# Altium schematic sheet Armado de cable.SchDoc
size 145 x 103 mm
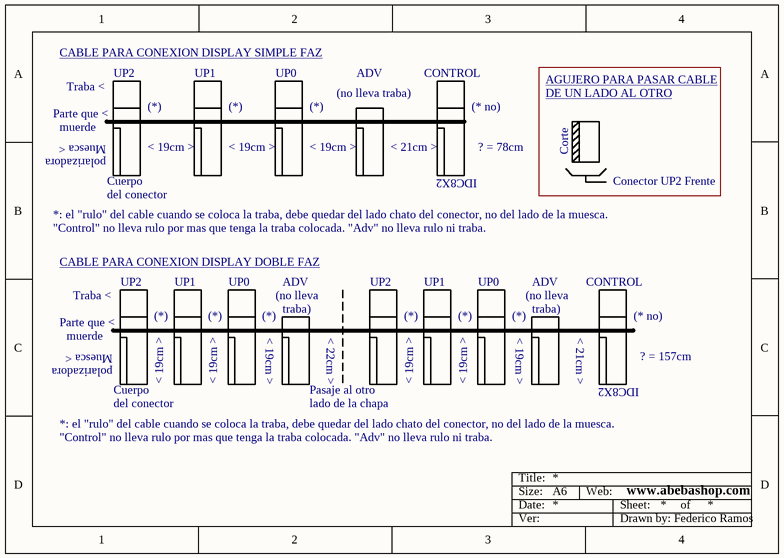
[diagram p0: Armado de cable.SchDoc]

## Notes on the sheet
- CABLE PARA CONEXION DISPLAY SIMPLE FAZ
- Traba <
- UP2
- UP1
- UP0
- (no lleva traba)
- ADV
- CONTROL
- AGUJERO PARA PASAR CABLE
- DE UN LADO AL OTRO
- Parte que <
- muerde
- Muesca <
- polarizadora
- < 19cm >
- (*)
- < 21cm >
- (* no)
- ? = 78cm
- IDC8X2
- Corte
- *: el "rulo" del cable cuando se coloca la traba, debe quedar del lado chato del conector, no del lado de la muesca.
- "Control" no lleva rulo por mas que tenga la traba colocada. "Adv" no lleva rulo ni traba.
- Cuerpo
- del conector
- Conector UP2 Frente
- CABLE PARA CONEXION DISPLAY DOBLE FAZ
- (no lleva
- traba)
- < 22cm >
- ? = 157cm
- Pasaje al otro
- lado de la chapa
- Title:
- Size:
- Date:
- A6
- Web:
- Sheet:
- www.abebashop.com
- of
- Ver:
- Drawn by: Federico Ramos